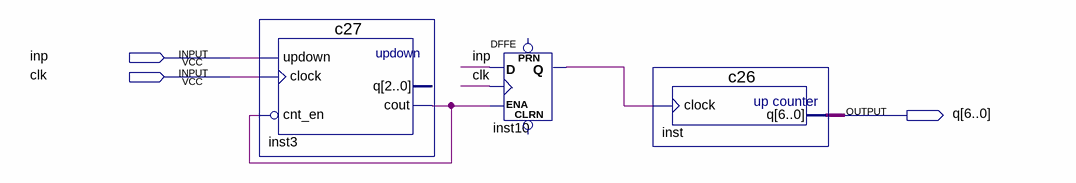
[diagram p0: schematic sheet]
// Quartus schematic p7.bdf as structural Verilog: 3 symbols, 3 pins
module p7 (
  input  inp,
  input  clk,
  output [6:0] q
);

  wire inst3_cout, inst10_q;

  c27 inst3 (.updown(inp), .clock(clk), .cnt_en(~inst3_cout), .cout(inst3_cout));  // open: q
  DFFE inst10 (.D(inp), .CLK(clk), .ENA(inst3_cout), .Q(inst10_q));  // open: PRN, CLRN
  c26 inst (.clock(inst10_q), .q(q));
endmodule
